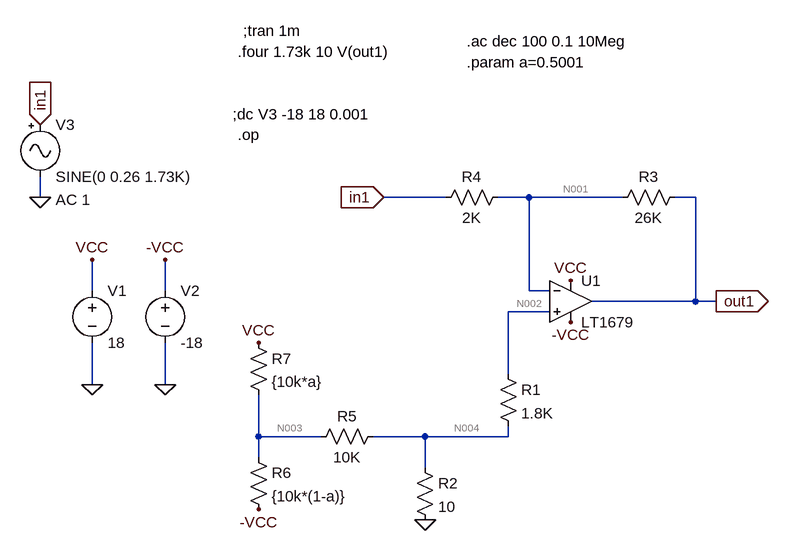
[diagram p0: schematic Etaj1.asc]
* Etaj1.asc
V1 VCC 0 18
V2 -VCC 0 -18
R1 N002 N004 1.8K
R2 N004 0 10
R3 out1 N001 26K
R4 N001 in1 2K
R5 N003 N004 10K
R6 N003 -VCC {10k*(1-a)}
R7 VCC N003 {10k*a}
* U1: LT1679 (symbol OpAmps\LT1679 not available, pins judged from their places): In+=N002 In-=N001 V+=VCC V-=-VCC OUT=out1
V3 in1 0 SINE(0 0.26 1.73K) AC 1
;dc V3 -18 18 0.001
.op
.param a=0.5001
.ac dec 100 0.1 10Meg
;tran 1m
.four 1.73k 10 V(out1)
.backanno
.end

* Results of the author's LTspice run, read from the files saved beside the schematic
* Operating Point, zero values left out:
*   V(vcc) = 18 V
*   V(-vcc) = -18 V
*   V(n002) = -3.146 µV
*   V(n004) = -2.879 µV
*   V(out1) = -6.552 µV
*   V(n001) = -743.2 nV
*   V(n003) = -2.881 mV
*   I(R7) = 3.6 mA
*   I(R6) = 3.6 mA
*   I(R5) = -287.8 nA
*   I(R4) = -371.6 pA
*   I(R3) = -223.4 pA
*   I(R2) = -287.9 nA
*   I(R1) = -148.2 pA
*   I(V3) = -371.6 pA
*   I(V2) = 6.165 mA
*   I(V1) = -6.164 mA
*   Ix(u1:1) = 148.2 pA
*   Ix(u1:2) = 148.2 pA
*   Ix(u1:3) = 178.4 pA
*   Ix(u1:4) = 2.564 mA
*   Ix(u1:5) = -2.564 mA
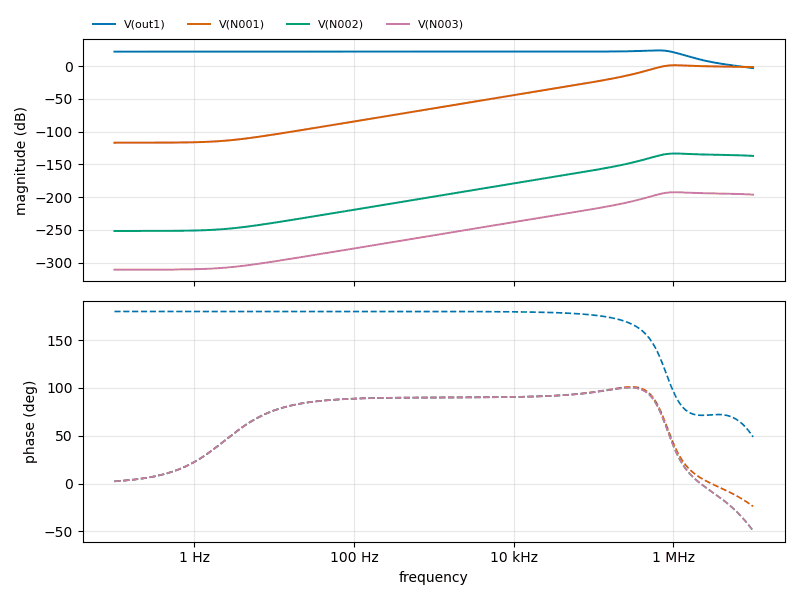
[diagram p1: AC Analysis of Etaj1.asc, plotted from the saved traces]
* AC Analysis, 1 run:
*   V(out1): 22.28 dB at 100 mHz, -2.90 dB at 10 MHz, peak 24.16 dB at 645.7 kHz, 3 dB below the peak at 1.024 MHz
*   V(N001): -116.85 dB at 100 mHz, -1.26 dB at 10 MHz, peak 1.48 dB at 1.047 MHz, 3 dB below the peak at 664.8 kHz
*   V(N002): -251.69 dB at 100 mHz, -137.00 dB at 10 MHz, peak -133.38 dB at 1.047 MHz, 3 dB below the peak at 664.4 kHz and 7.949 MHz
*   V(N003): -310.83 dB at 100 mHz, -196.14 dB at 10 MHz, peak -192.52 dB at 1.047 MHz, 3 dB below the peak at 664.4 kHz and 7.949 MHz
* From the log:
*   Semiconductor Device Operating Points:
*                           --- Diodes ---
*   Name:    d:u1:1      d:u1:15     d:u1:7      d:u1:13     d:u1:12
*   Model:   u1:dlim     u1:dinp      u1:dp     u1:dbiaot   u1:dbiaot
*   Id:      3.93e-09   -2.40e-16    8.40e-04   -1.80e-11   -1.80e-11
*   Vd:      2.75e-02   -2.40e-06    3.60e+01   -1.80e+01   -1.80e+01
*   Req:     1.43e-07    1.00e-10    1.00e-03    1.00e-12    1.00e-12
*   CAP:     0.00e+00    0.00e+00    0.00e+00    0.00e+00    0.00e+00
*   Name:    d:u1:6      d:u1:9      d:u1:10     d:u1:8      d:u1:5
*   Model:  u1:dlimn2   u1:dbia1    u1:dbia1    u1:dlimp    u1:dlimn1
*   Id:      6.17e-10   -1.66e-10   -1.66e-10    6.12e-09    2.06e-10
*   Vd:      6.17e-01   -1.66e+01   -1.66e+01    6.12e-01    6.17e-01
*   Req:     1.00e-09    1.00e-11    1.00e-11    1.00e-08    3.33e-10
*   CAP:     0.00e+00    0.00e+00    0.00e+00    0.00e+00    0.00e+00
*   Name:    d:u1:4
*   Model:  u1:dbia2
*   Id:      3.46e-05
*   Vd:      1.38e+00
*   Req:     1.00e-03
*   CAP:     0.00e+00
*                           --- VDMOSFET Transistors ---
*   Name:        m:u1:2      m:u1:1
*   Model:        u1:pi       u1:ni
*   Id:         -1.69e-03    1.69e-03
*   Vgs:        -6.12e-01    6.17e-01
*   Vds:        -1.80e+01    1.80e+01
*   Vth:        -3.00e-01    3.00e-01
*   Gm:          1.09e-02    1.09e-02
*   Gds:         1.43e-05    1.43e-05
*   Cgs:         0.00e+00    0.00e+00
*   Cgd:         0.00e+00    0.00e+00
*   Cbody:       0.00e+00    0.00e+00
*   Note: .fourier statements are only valid with a .tran command.
*         No Fourier analysis performed.